# Altium schematic sheet Sheet2.SchDoc
size A4
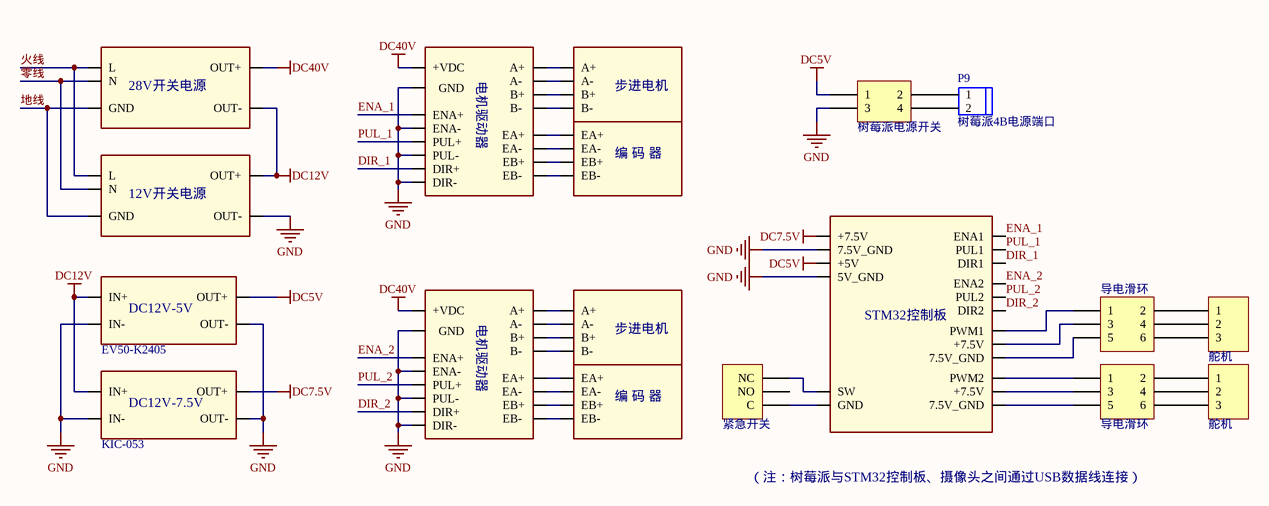
[diagram p0: Sheet2.SchDoc]

## Parts
(Parts that share a designator on the sheet are numbered #1, #2 ... from top to bottom, then left to right.)
P8  紧急开关  [HDR1X3]
P9  树莓派4B电源端口  [KF301-2P]
P?#1  树莓派电源开关  [HDR2X2]
P?#2  导电滑环  [HDR2X3H]
P?#3  舵机  [HDR1X3]
P?#4  导电滑环  [HDR2X3H]
P?#5  舵机  [HDR1X3]
U5  28V开关电源  (value not drawn)
U7  57步进电机  (value not drawn)
U8  12V开关电源  (value not drawn)
U9  EV50-K2405
U10  KIC-053
U12  57步进电机  (value not drawn)
U?#1  电机驱动器  (value not drawn)
U?#2  STM32控制板  (value not drawn)
U?#3  电机驱动器  (value not drawn)

## Nets
DC5V: P?#1.1 U9.3(OUT+) U?#2.2(+5V)
DC7.5V: U10.3(OUT+) U?#2.0(+7.5V)
DC12V: U5.3(OUT-) U8.4(OUT+) U9.0(IN+) U10.0(IN+)
DC40V: U5.4(OUT+) U?#1.0(+VDC) U?#3.0(+VDC)
GND: P?#1.3 U8.3(OUT-) U9.1(IN-) U9.2(OUT-) U10.1(IN-) U10.2(OUT-) U?#1.1(GND) U?#1.7(ENA-) U?#1.9(PUL-) U?#1.11(DIR-) U?#2.1(7.5V_GND) U?#2.3(5V_GND) U?#3.1(GND) U?#3.7(ENA-) U?#3.9(PUL-) U?#3.11(DIR-)
DIR_1: U?#1.10(DIR+) U?#2.8(DIR1)
DIR_2: U?#2.9(DIR2) U?#3.10(DIR+)
ENA_1: U?#1.6(ENA+) U?#2.4(ENA1)
ENA_2: U?#2.5(ENA2) U?#3.6(ENA+)
PUL_1: U?#1.8(PUL+) U?#2.6(PUL1)
PUL_2: U?#2.7(PUL2) U?#3.8(PUL+)
地线: U5.2(GND) U8.2(GND)
火线: U5.0(L) U8.0(L)
零线: U5.1(N) U8.1(N)
NetP8_1: P8.1(NC) U?#2.16(SW)
NetP8_3: P8.3(C) U?#2.17(GND)
NetP9_1: P9.1 P?#1.2
NetP9_2: P9.2 P?#1.4
NetP?#2_1: P?#2.1 U?#2.12(PWM1)
NetP?#2_2: P?#2.2 P?#3.1
NetP?#2_3: P?#2.3 U?#2.11(+7.5V)
NetP?#2_4: P?#2.4 P?#3.2
NetP?#2_5: P?#2.5 U?#2.14(7.5V_GND)
NetP?#2_6: P?#2.6 P?#3.3
NetP?#4_1: P?#4.1 U?#2.13(PWM2)
NetP?#4_2: P?#4.2 P?#5.1
NetP?#4_3: P?#4.3 U?#2.10(+7.5V)
NetP?#4_4: P?#4.4 P?#5.2
NetP?#4_5: P?#4.5 U?#2.15(7.5V_GND)
NetP?#4_6: P?#4.6 P?#5.3
NetU7_0: U7.0(A+) U?#1.2(A+)
NetU7_0: U7.0(EA+) U?#1.2(EA+)  [a separate net that carries the same name]
NetU7_1: U7.1(A-) U?#1.3(A-)
NetU7_1: U7.1(EA-) U?#1.3(EA-)  [a separate net that carries the same name]
NetU7_2: U7.2(B+) U?#1.4(B+)
NetU7_2: U7.2(EB+) U?#1.4(EB+)  [a separate net that carries the same name]
NetU7_3: U7.3(B-) U?#1.5(B-)
NetU7_3: U7.3(EB-) U?#1.5(EB-)  [a separate net that carries the same name]
NetU12_0: U12.0(A+) U?#3.2(A+)
NetU12_0: U12.0(EA+) U?#3.2(EA+)  [a separate net that carries the same name]
NetU12_1: U12.1(A-) U?#3.3(A-)
NetU12_1: U12.1(EA-) U?#3.3(EA-)  [a separate net that carries the same name]
NetU12_2: U12.2(B+) U?#3.4(B+)
NetU12_2: U12.2(EB+) U?#3.4(EB+)  [a separate net that carries the same name]
NetU12_3: U12.3(B-) U?#3.5(B-)
NetU12_3: U12.3(EB-) U?#3.5(EB-)  [a separate net that carries the same name]

Not connected (* = marked no-connect by the designer): P8 2(NO)

## Notes on the sheet
- （注：树莓派与STM32控制板、摄像头之间通过USB数据线连接）
- (in symbol 57步进电机) 步进电机; 编 码 器

## Library data of the parts
P8 P?#3 P?#5 = Header 3: Header, 3-Pin; LatestRevisionDate: 17-Jul-2002; LatestRevisionNote: Re-released for DXP Platform.; Publisher: Altium Limited
P9 = 2P接线端子
P?#1 = Header 2X2: Header, 2-Pin, Dual row; LatestRevisionDate: 17-Jul-2002; LatestRevisionNote: Re-released for DXP Platform.; Publisher: Altium Limited
P?#2 P?#4 = Header 3X2H: Header, 3-Pin, Dual row, Right Angle; LatestRevisionDate: 17-Jul-2002; LatestRevisionNote: Re-released for DXP Platform.; Publisher: Altium Limited
U9 = DC12V-5V
U10 = DC12V-7.5V